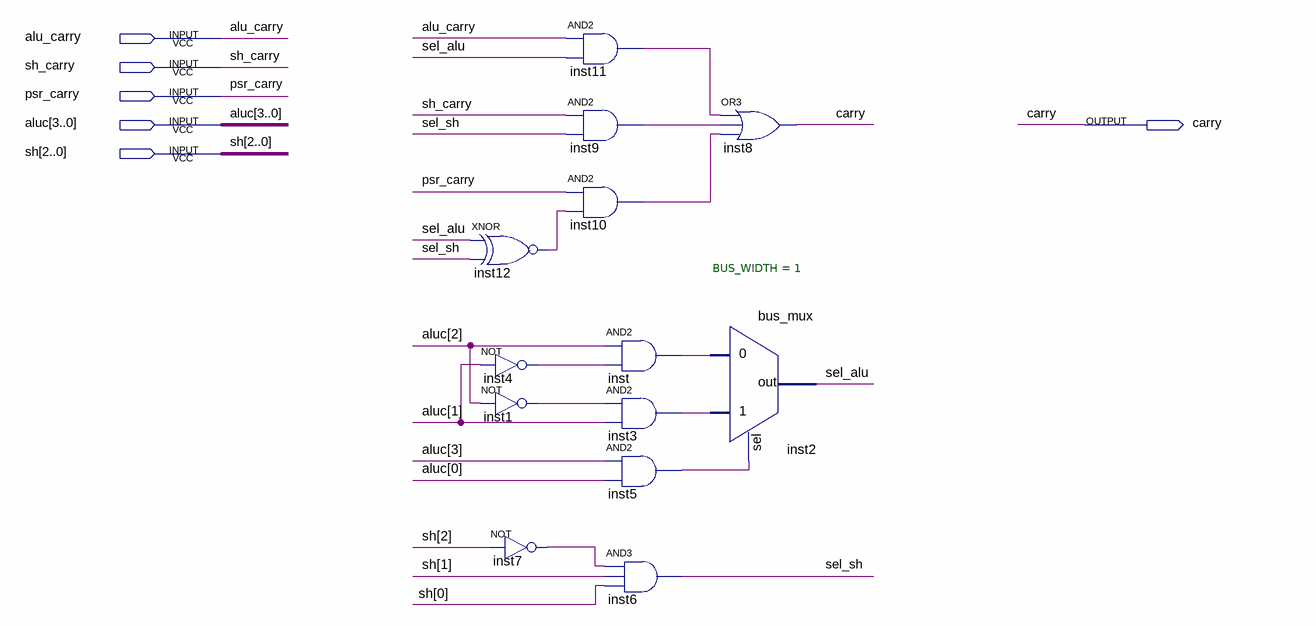
[diagram p0: schematic sheet]
// Quartus schematic uc_carry.bdf as structural Verilog: 13 symbols, 6 pins
module uc_carry (
  input  alu_carry,
  input  sh_carry,
  input  psr_carry,
  input  [3:0] aluc,
  input  [2:0] sh,
  output carry
);

  wire inst1_out, inst3_out, inst4_out, inst5_out, inst7_out, inst9_out, inst10_out, inst11_out, inst12_out,
       inst_out, sel_alu, sel_sh;

  xnor inst12 (inst12_out, sel_alu, sel_sh);
  not inst4 (inst4_out, aluc[1]);
  not inst1 (inst1_out, aluc[2]);
  not inst7 (inst7_out, sh[2]);
  and inst11 (inst11_out, alu_carry, sel_alu);
  and inst9 (inst9_out, sh_carry, sel_sh);
  and inst10 (inst10_out, psr_carry, inst12_out);
  and inst (inst_out, aluc[2], inst4_out);
  and inst3 (inst3_out, inst1_out, aluc[1]);
  and inst5 (inst5_out, aluc[3], aluc[0]);
  and inst6 (sel_sh, inst7_out, sh[1], sh[0]);
  or inst8 (carry, inst11_out, inst9_out, inst10_out);
  bus_mux #(.BUS_WIDTH(1)) inst2 (.in0(inst_out), .in1(inst3_out), .sel(inst5_out), .out(sel_alu));
endmodule
